# Altium schematic sheet ET-DAC.SchDoc
size A4
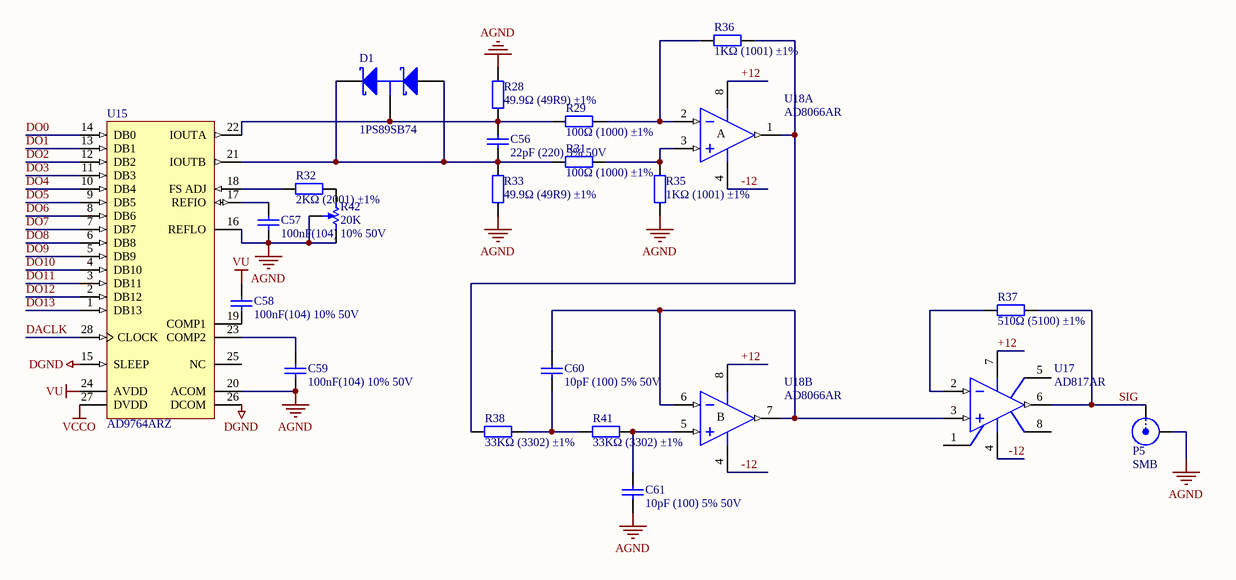
[diagram p0: ET-DAC.SchDoc]

## Parts
C56  22pF (220) 5% 50V  [LC-0805_C]
C57  100nF(104) 10% 50V  [LC-0805_C]
C58  100nF(104) 10% 50V  [LC-0805_C]
C59  100nF(104) 10% 50V  [LC-0805_C]
C60  10pF (100) 5% 50V  [LC-0805_C]
C61  10pF (100) 5% 50V  [LC-0805_C]
D1  1PS89SB74  [SOT23_M]
P5  SMB  [SMB_V-RJ45]
R28  49.9Ω (49R9) ±1%  [LC-0805_R]
R29  100Ω (1000) ±1%  [LC-0805_R]
R31  100Ω (1000) ±1%  [LC-0805_R]
R32  2KΩ (2001) ±1%  [LC-0805_R]
R33  49.9Ω (49R9) ±1%  [LC-0805_R]
R35  1KΩ (1001) ±1%  [LC-0805_R]
R36  1KΩ (1001) ±1%  [LC-0805_R]
R37  510Ω (5100) ±1%  [LC-0805_R]
R38  33KΩ (3302) ±1%  [LC-0805_R]
R41  33KΩ (3302) ±1%  [LC-0805_R]
R42  20K  [POT4MM-2]
U15  AD9764ARZ  [RW-28_N]
U17  AD817AR  [SO-8_N]
U18  AD8066AR  [SO-8_N]  (parts A,B of 2)

## Nets
AGND: C57.1 C59.1 C61.1 P5.2(Y) R28.2 R33.1 R35.2 R42.CW(+) R42.W U15.16(REFLO) U15.20(ACOM)
DGND: U15.15(SLEEP) U15.26(DCOM)
VCCO: U15.27(DVDD)
VU: C58.2 U15.24(AVDD)
+12: U17.7(V+) U18.8(V+)
-12: U17.4(V-) U18.4(V-)
DACLK: U15.28(CLOCK)
DO0: U15.14(DB0)
DO1: U15.13(DB1)
DO2: U15.12(DB2)
DO3: U15.11(DB3)
DO4: U15.10(DB4)
DO5: U15.9(DB5)
DO6: U15.8(DB6)
DO7: U15.7(DB7)
DO8: U15.6(DB8)
DO9: U15.5(DB9)
DO10: U15.4(DB10)
DO11: U15.3(DB11)
DO12: U15.2(DB12)
DO13: U15.1(DB13)
SIG: P5.1(X) R37.2 U17.6(OUT)
NetC56_1: C56.1 D1.1(A) D1.2(K) R31.1 R33.2 U15.21(IOUTB)
NetC56_2: C56.2 D1.3(C) R28.1 R29.1 U15.22(IOUTA)
NetC57_2: C57.2 U15.17(REFIO)
NetC58_1: C58.1 U15.19(COMP1)
NetC59_2: C59.2 U15.23(COMP2)
NetC60_1: C60.1 R38.2 R41.1
NetC60_2: C60.2 U17.3(IN+) U18.6(IN-) U18.7(OUT)
NetC61_2: C61.2 R41.2 U18.5(IN+)
NetR29_2: R29.2 R36.2 U18.2(IN-)
NetR31_2: R31.2 R35.1 U18.3(IN+)
NetR32_1: R32.1 R42.CCW(-)
NetR32_2: R32.2 U15.18(FS_ADJ)
NetR36_1: R36.1 R38.1 U18.1(OUT)
NetR37_1: R37.1 U17.2(IN-)

Not connected (* = marked no-connect by the designer): U15 25(NC); U17 1(NULL1) 5(NC) 8(NULL2)

## Notes on the sheet
- (in symbol AD8056AR, part A) A
- (in symbol AD8056AR, part B) B

## Library data of the parts
C56 = 0805 22pF (220) 5% 50V: 贴片电容; ComponentLink1Description: 供应商链接; ComponentLink1URL: http://www.szlcsc.com/product/details_2156.html; Package: 0805; Supplier: LC; SuppliersPartNumber: C1804
C57-C59 = 0805 100nF(104) 10% 50V: 贴片电容; ComponentLink1Description: 供应商链接; ComponentLink1URL: http://www.szlcsc.com/product/details_50686.html; Package: 0805; Supplier: LC; SuppliersPartNumber: C49678
C60 C61 = 0805 10pF (100) 5% 50V: 贴片电容; ComponentLink1Description: 供应商链接; ComponentLink1URL: http://www.szlcsc.com/product/details_2137.html; Package: 0805; Supplier: LC; SuppliersPartNumber: C1785
D1 = 1PS89SB74: Schottky Barrier Double Diode; Published: 17-Sep-2003; DatasheetVersion: 20-Apr-2001; PackageVersion: Oct-1998; PackageReference: SOT490; Publisher: Altium Limited; PackageDescription: SC-89; 3 Flat Leads; Body 1.6 x 1.6 x 0.7 mm, inc leads (LxWxH typ); ComponentLink1Description: Manufacturer Link; ComponentLink1URL: http://www.semiconductors.philips.com/; ComponentLink2Description: Datasheet; ComponentLink2URL: http://www.semiconductors.philips.com/acrobat/datasheets/1PS89SB74_1.pdf
P5 = SMB: SMB Straight Connector; LatestRevisionDate: 17-Jul-2002; LatestRevisionNote: Re-released for DXP Platform.; Publisher: Altium Limited
R28 R33 = 0805 49.9Ω (49R9) 1%: 贴片电阻; ComponentLink1Description: 供应商链接; ComponentLink1URL: http://www.szlcsc.com/product/details_18408.html; Package: 0805; Supplier: LC; SuppliersPartNumber: C17720
R29 R31 = 0805 100Ω (1000) 1%: 贴片电阻; ComponentLink1Description: 供应商链接; ComponentLink1URL: http://www.szlcsc.com/product/details_18096.html; Package: 0805; Supplier: LC; SuppliersPartNumber: C17408
R32 = 0805 2KΩ (2001) 1%: 贴片电阻; ComponentLink1Description: 供应商链接; ComponentLink1URL: http://www.szlcsc.com/product/details_18292.html; Package: 0805; Supplier: LC; SuppliersPartNumber: C17604
R35 R36 = 0805 1KΩ (1001) 1%: 贴片电阻; ComponentLink1Description: 供应商链接; ComponentLink1URL: http://www.szlcsc.com/product/details_18201.html; Package: 0805; Supplier: LC; SuppliersPartNumber: C17513
R37 = 0805 510Ω (5100) 1%: 贴片电阻; ComponentLink1Description: 供应商链接; ComponentLink1URL: http://www.szlcsc.com/product/details_18422.html; Package: 0805; Supplier: LC; SuppliersPartNumber: C17734
R38 R41 = 0805 33KΩ (3302) 1%: 贴片电阻; ComponentLink1Description: 供应商链接; ComponentLink1URL: http://www.szlcsc.com/product/details_18321.html; Package: 0805; Supplier: LC; SuppliersPartNumber: C17633
R42 = RPot SM: Square Trimming Potentiometer; Published: 17-Dec-2003; DatasheetVersion: Oct-2003; PackageReference: POT4MM-2; Publisher: Altium Limited; PackageDescription: Square Trimming Potentiometer; ComponentLink1Description: Manufacturer Link; ComponentLink1URL: http://bourns.com/2/search.html
U15 = AD9764ARZ: Single 14-Bit TxDAC, 125 Msps, -40 to +85 degC, RW-28, Pb-Free, Tube; Generic Part Number: AD9764; Manufacturer: Analog Devices; # DAC Outputs: 1; Max V+: 5.5V; Op Pwr Diss: 170mW; Resolution (Bits): 14; Settling Time: 35ns; Single Supply: Yes; DatasheetVersion: Rev.B; PackageVersion: 060706-A; PackageReference: RW-28; PackageDescription: 28-Lead Standard Small Outline Package [SOIC_W]; Supplier 1: Digi-Key; Supplier Part Number 1: AD9764ARZ-ND; Supplier 2: Farnell; Supplier Part Number 2: 9425640; Supplier 3: Newark; Supplier Part Number 3: 59K7408; Supplier 4: Mouser; Supplier Part Number 4: 584-AD9764ARZ; Packing: Tube; RoHS: Y; Mounting Technology: Surface Mount; Code_JEDEC: MS-013-AE; PartNumber: AD9764ARZ; ComponentLink1Description: Manufacturer URL; ComponentLink1URL: http://www.analog.com/en/index.html; ComponentLink2Description: Datasheet; ComponentLink2URL: http://www.analog.com/static/imported-files/data_sheets/AD9764.pdf; ComponentLink3Description: Product URL; ComponentLink3URL: http://www.analog.com/en/digital-to-analog-converters/da-converters/ad9764/products/product.html
U17 = AD817AR: High-Speed, Low-Power Wide Supply Range Amplifier; Note: Pin 5 is not connected.; Published: 8-Jun-2000; LatestRevisionDate: 13-Apr-2006; LatestRevisionNote: IPC-7351 Footprint Added.; DatasheetVersion: REV. B 1995; PackageVersion: revA; PackageReference: SO-8; Publisher: Altium Limited; PackageDescription: 8-Pin Small Outline Integrated Circuit 1.27 mm Pitch; Code_JEDEC: MS-012-AA; Code_IPC: SOIC127P600-8; ComponentLink1Description: Manufacturer Link; ComponentLink1URL: http://www.analog.com/en/prod/0,,759_786_AD817%2C00.html; ComponentLink2Description: Datasheet; ComponentLink2URL: http://www.analog.com/UploadedFiles/Data_Sheets/289066266ad817.pdf
U18 = AD8056AR: Low Cost, 300MHz Voltage Feedback Amplifier; Published: 8-Jun-2000; LatestRevisionDate: 13-Apr-2006; LatestRevisionNote: IPC-7351 Footprint Added.; DatasheetVersion: REV. 0 1997; PackageVersion: revA; PackageReference: SO-8; Publisher: Altium Limited; PackageDescription: 8-Pin Small Outline Integrated Circuit 1.27 mm Pitch; Code_JEDEC: MS-012-AA; Code_IPC: SOIC127P600-8; ComponentLink1Description: Manufacturer Link; ComponentLink1URL: http://www.analog.com/en/prod/0,,759_786_AD8055%2C00.html; ComponentLink2Description: Datasheet; ComponentLink2URL: http://www.analog.com/UploadedFiles/Data_Sheets/40402558757264AD8055_6_i.pdf